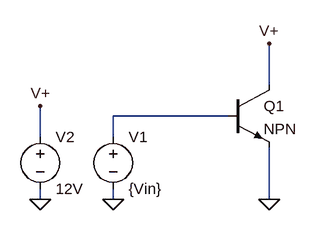
[diagram p0: schematic DRAFT14.asc]
DRAFT14.asc, the LTspice schematic file:
Version 4
SHEET 1 880 680
WIRE 288 112 288 48
WIRE 224 160 48 160
WIRE -64 192 -64 144
WIRE 48 192 48 160
WIRE -64 288 -64 272
WIRE 48 288 48 272
WIRE 288 288 288 208
FLAG 288 288 0
FLAG 48 288 0
FLAG -64 144 V+
FLAG 288 48 V+
FLAG -64 288 0
SYMBOL npn 224 112 R0
SYMATTR InstName Q1
SYMBOL voltage 48 176 R0
WINDOW 123 0 0 Left 0
WINDOW 39 0 0 Left 0
SYMATTR InstName V1
SYMATTR Value {Vin}
SYMBOL voltage -64 176 R0
WINDOW 123 0 0 Left 0
WINDOW 39 0 0 Left 0
SYMATTR InstName V2
SYMATTR Value 12V

The netlist it stands for:
* DRAFT14.asc
Q1 V+ N001 0 0 NPN
V1 N001 0 {Vin}
V2 V+ 0 12V
.model NPN NPN
.model PNP PNP
.lib standard.bjt
.backanno
.end